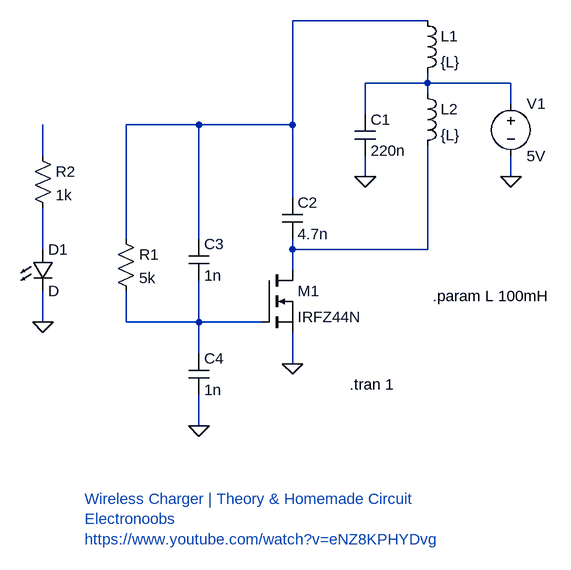
[diagram p0: schematic WireLessCharger1.asc]
WireLessCharger1.asc, the LTspice schematic file:
Version 4
SHEET 1 880 680
WIRE 464 -512 256 -512
WIRE 464 -416 464 -432
WIRE 464 -416 368 -416
WIRE 592 -416 464 -416
WIRE 464 -400 464 -416
WIRE 592 -384 592 -416
WIRE 368 -368 368 -416
WIRE 112 -352 0 -352
WIRE 256 -352 256 -512
WIRE 256 -352 112 -352
WIRE -128 -304 -128 -352
WIRE 368 -272 368 -304
WIRE 592 -272 592 -304
WIRE 256 -240 256 -352
WIRE 0 -176 0 -352
WIRE 112 -176 112 -352
WIRE -128 -160 -128 -224
WIRE 256 -160 256 -176
WIRE 464 -160 464 -320
WIRE 464 -160 256 -160
WIRE 256 -128 256 -160
WIRE -128 -48 -128 -96
WIRE 0 -48 0 -96
WIRE 112 -48 112 -112
WIRE 112 -48 0 -48
WIRE 208 -48 112 -48
WIRE 112 0 112 -48
WIRE 256 16 256 -32
WIRE 112 112 112 64
FLAG 592 -272 0
FLAG 368 -272 0
FLAG 112 112 0
FLAG -128 -48 0
FLAG 256 16 0
SYMBOL nmos 208 -128 R0
SYMATTR InstName M1
SYMATTR Value IRFZ44N
SYMBOL ind 448 -528 R0
SYMATTR InstName L1
SYMATTR Value {L}
SYMBOL ind 448 -416 R0
SYMATTR InstName L2
SYMATTR Value {L}
SYMBOL voltage 592 -400 R0
WINDOW 123 0 0 Left 0
WINDOW 39 0 0 Left 0
SYMATTR InstName V1
SYMATTR Value 5V
SYMBOL cap 352 -368 R0
SYMATTR InstName C1
SYMATTR Value 220n
SYMBOL cap 240 -240 R0
SYMATTR InstName C2
SYMATTR Value 4.7n
SYMBOL cap 96 -176 R0
SYMATTR InstName C3
SYMATTR Value 1n
SYMBOL cap 96 0 R0
SYMATTR InstName C4
SYMATTR Value 1n
SYMBOL res -16 -192 R0
SYMATTR InstName R1
SYMATTR Value 5k
SYMBOL res -144 -320 R0
SYMATTR InstName R2
SYMATTR Value 1k
SYMBOL LED -144 -160 R0
SYMATTR InstName D1
TEXT -64 224 Left 2 ;Wireless Charger | Theory & Homemade Circuit\nElectronoobs\nhttps://www.youtube.com/watch?v=eNZ8KPHYDvg
TEXT 344 48 Left 2 !.tran 1
TEXT 472 -88 Left 2 !.param L 100mH

The netlist it stands for:
* WireLessCharger1.asc
M1 N005 N006 0 0 IRFZ44N
L1 N001 N002 {L}
L2 N002 N005 {L}
V1 N002 0 5V
C1 N002 0 220n
C2 N001 N005 4.7n
C3 N001 N006 1n
C4 N006 0 1n
R1 N001 N006 5k
R2 N003 N004 1k
D1 N004 0 D
.model D D
.lib standard.dio
.model NMOS NMOS
.model PMOS PMOS
.lib standard.mos
* Wireless Charger | Theory & Homemade Circuit
* Electronoobs
* https://www.youtube.com/watch?v=eNZ8KPHYDvg
.tran 1
.param L 100mH
.backanno
.end